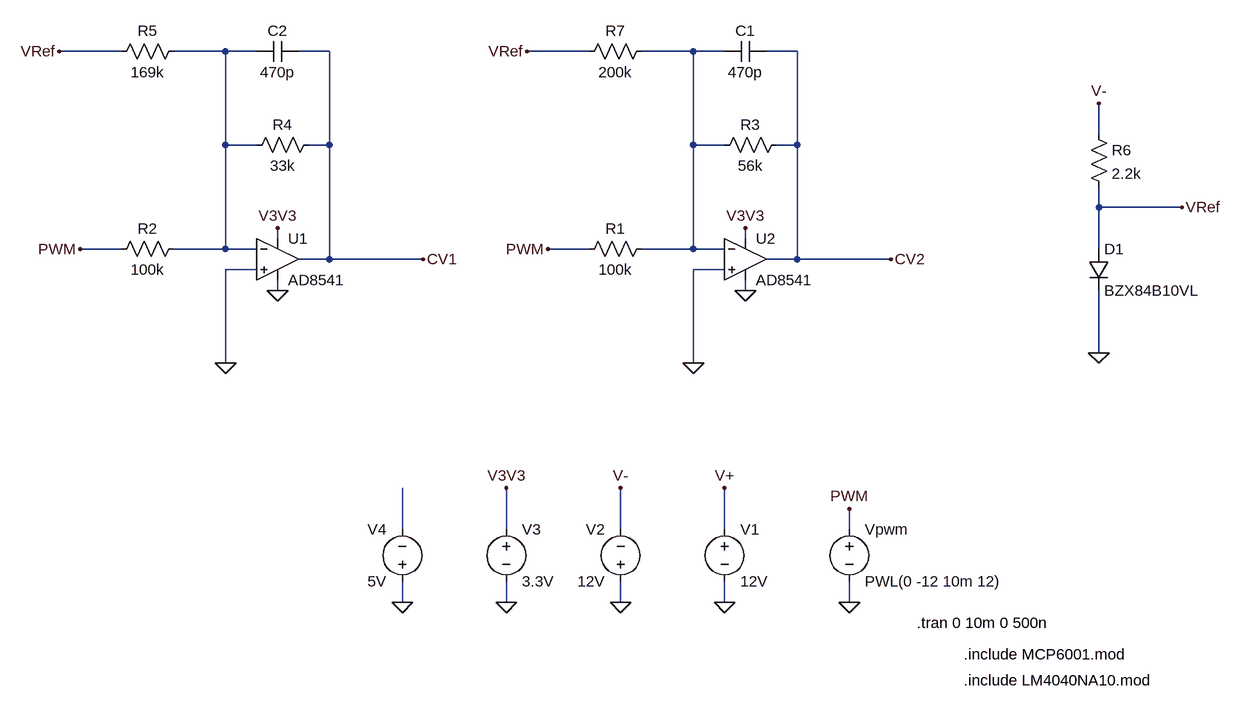
[diagram p0: schematic CV.asc]
CV.asc, the LTspice schematic file:
Version 4
SHEET 1 2248 680
WIRE -1040 -608 -1136 -608
WIRE -880 -608 -960 -608
WIRE -832 -608 -880 -608
WIRE -720 -608 -768 -608
WIRE -320 -608 -416 -608
WIRE -160 -608 -240 -608
WIRE -112 -608 -160 -608
WIRE 0 -608 -48 -608
WIRE 464 -480 464 -528
WIRE -880 -464 -880 -608
WIRE -832 -464 -880 -464
WIRE -720 -464 -720 -608
WIRE -720 -464 -752 -464
WIRE -160 -464 -160 -608
WIRE -112 -464 -160 -464
WIRE 0 -464 0 -608
WIRE 0 -464 -32 -464
WIRE 464 -368 464 -400
WIRE 592 -368 464 -368
WIRE -800 -320 -800 -336
WIRE -80 -320 -80 -336
WIRE -1040 -304 -1104 -304
WIRE -880 -304 -880 -464
WIRE -880 -304 -960 -304
WIRE -832 -304 -880 -304
WIRE -320 -304 -384 -304
WIRE -160 -304 -160 -464
WIRE -160 -304 -240 -304
WIRE -112 -304 -160 -304
WIRE 464 -304 464 -368
WIRE -720 -288 -720 -464
WIRE -720 -288 -768 -288
WIRE -576 -288 -720 -288
WIRE 0 -288 0 -464
WIRE 0 -288 -48 -288
WIRE 144 -288 0 -288
WIRE -832 -272 -880 -272
WIRE -112 -272 -160 -272
WIRE -800 -240 -800 -256
WIRE -80 -240 -80 -256
WIRE 464 -144 464 -240
WIRE -880 -128 -880 -272
WIRE -160 -128 -160 -272
WIRE -608 128 -608 64
WIRE -448 128 -448 64
WIRE -272 128 -272 64
WIRE -112 128 -112 64
WIRE 80 128 80 96
WIRE -608 240 -608 208
WIRE -448 240 -448 208
WIRE -272 240 -272 208
WIRE -112 240 -112 208
WIRE 80 240 80 208
FLAG 80 240 0
FLAG 80 96 PWM
FLAG -384 -304 PWM
FLAG -112 240 0
FLAG -272 240 0
FLAG -448 240 0
FLAG -448 64 V3V3
FLAG -272 64 V-
FLAG -112 64 V+
FLAG 144 -288 CV2
FLAG -80 -240 0
FLAG -80 -336 V3V3
FLAG -160 -128 0
FLAG -416 -608 VRef
FLAG -608 240 0
FLAG 592 -368 VRef
FLAG 464 -144 0
FLAG 464 -528 V-
FLAG -1104 -304 PWM
FLAG -576 -288 CV1
FLAG -800 -240 0
FLAG -800 -336 V3V3
FLAG -880 -128 0
FLAG -1136 -608 VRef
SYMBOL voltage 80 112 R0
WINDOW 123 0 0 Left 2
WINDOW 39 0 0 Left 2
SYMATTR InstName Vpwm
SYMATTR Value PWL(0 -12 10m 12)
SYMBOL res -224 -320 R90
WINDOW 0 0 56 VBottom 2
WINDOW 3 32 56 VTop 2
SYMATTR InstName R1
SYMATTR Value 100k
SYMBOL /voltage -112 112 R0
SYMATTR InstName V1
SYMATTR Value 12V
SYMBOL /voltage -272 224 R180
WINDOW 0 24 96 Left 2
WINDOW 3 24 16 Left 2
SYMATTR InstName V2
SYMATTR Value 12V
SYMBOL /voltage -448 112 R0
WINDOW 123 0 0 Left 0
WINDOW 39 0 0 Left 0
SYMATTR InstName V3
SYMATTR Value 3.3V
SYMBOL res -16 -480 R90
WINDOW 0 0 56 VBottom 2
WINDOW 3 32 56 VTop 2
SYMATTR InstName R3
SYMATTR Value 56k
SYMBOL /Opamps/AD8541 -80 -352 R0
SYMATTR InstName U2
SYMBOL /voltage -608 224 R180
WINDOW 0 24 96 Left 2
WINDOW 3 24 16 Left 2
SYMATTR InstName V4
SYMATTR Value 5V
SYMBOL /cap -48 -624 R90
WINDOW 0 0 32 VBottom 2
WINDOW 3 32 32 VTop 2
SYMATTR InstName C1
SYMATTR Value 470p
SYMBOL /res 448 -496 R0
SYMATTR InstName R6
SYMATTR Value 2.2k
SYMBOL /diode 448 -304 R0
SYMATTR InstName D1
SYMATTR Value BZX84B10VL
SYMBOL /res -224 -624 R90
WINDOW 0 0 56 VBottom 2
WINDOW 3 32 56 VTop 2
SYMATTR InstName R7
SYMATTR Value 200k
SYMBOL res -944 -320 R90
WINDOW 0 0 56 VBottom 2
WINDOW 3 32 56 VTop 2
SYMATTR InstName R2
SYMATTR Value 100k
SYMBOL res -736 -480 R90
WINDOW 0 0 56 VBottom 2
WINDOW 3 32 56 VTop 2
SYMATTR InstName R4
SYMATTR Value 33k
SYMBOL /Opamps/AD8541 -800 -352 R0
SYMATTR InstName U1
SYMBOL /cap -768 -624 R90
WINDOW 0 0 32 VBottom 2
WINDOW 3 32 32 VTop 2
SYMATTR InstName C2
SYMATTR Value 470p
SYMBOL /res -944 -624 R90
WINDOW 0 0 56 VBottom 2
WINDOW 3 32 56 VTop 2
SYMATTR InstName R5
SYMATTR Value 169k
TEXT 184 272 Left 2 !.tran 0 10m 0 500n
TEXT 256 320 Left 2 !.include MCP6001.mod
TEXT 256 360 Left 2 !.include LM4040NA10.mod

The netlist it stands for:
* CV.asc
Vpwm PWM 0 PWL(0 -12 10m 12)
R1 N002 PWM 100k
V1 V+ 0 12V
V2 0 V- 12V
V3 V3V3 0 3.3V
R3 CV2 N002 56k
XU2 0 N002 V3V3 0 CV2 AD8541  ; pins In+ In- V+ V- OUT
V4 0 N003 5V
C1 CV2 N002 470p
R6 V- VRef 2.2k
D1 VRef 0 BZX84B10VL
R7 N002 VRef 200k
R2 N001 PWM 100k
R4 CV1 N001 33k
XU1 0 N001 V3V3 0 CV1 AD8541  ; pins In+ In- V+ V- OUT
C2 CV1 N001 470p
R5 N001 VRef 169k
.model D D
.lib standard.dio
.tran 0 10m 0 500n
.include MCP6001.mod
.include LM4040NA10.mod
.backanno
.end